# EAGLE design LoRa Mini v1.3 (EAGLE 7.5.0)
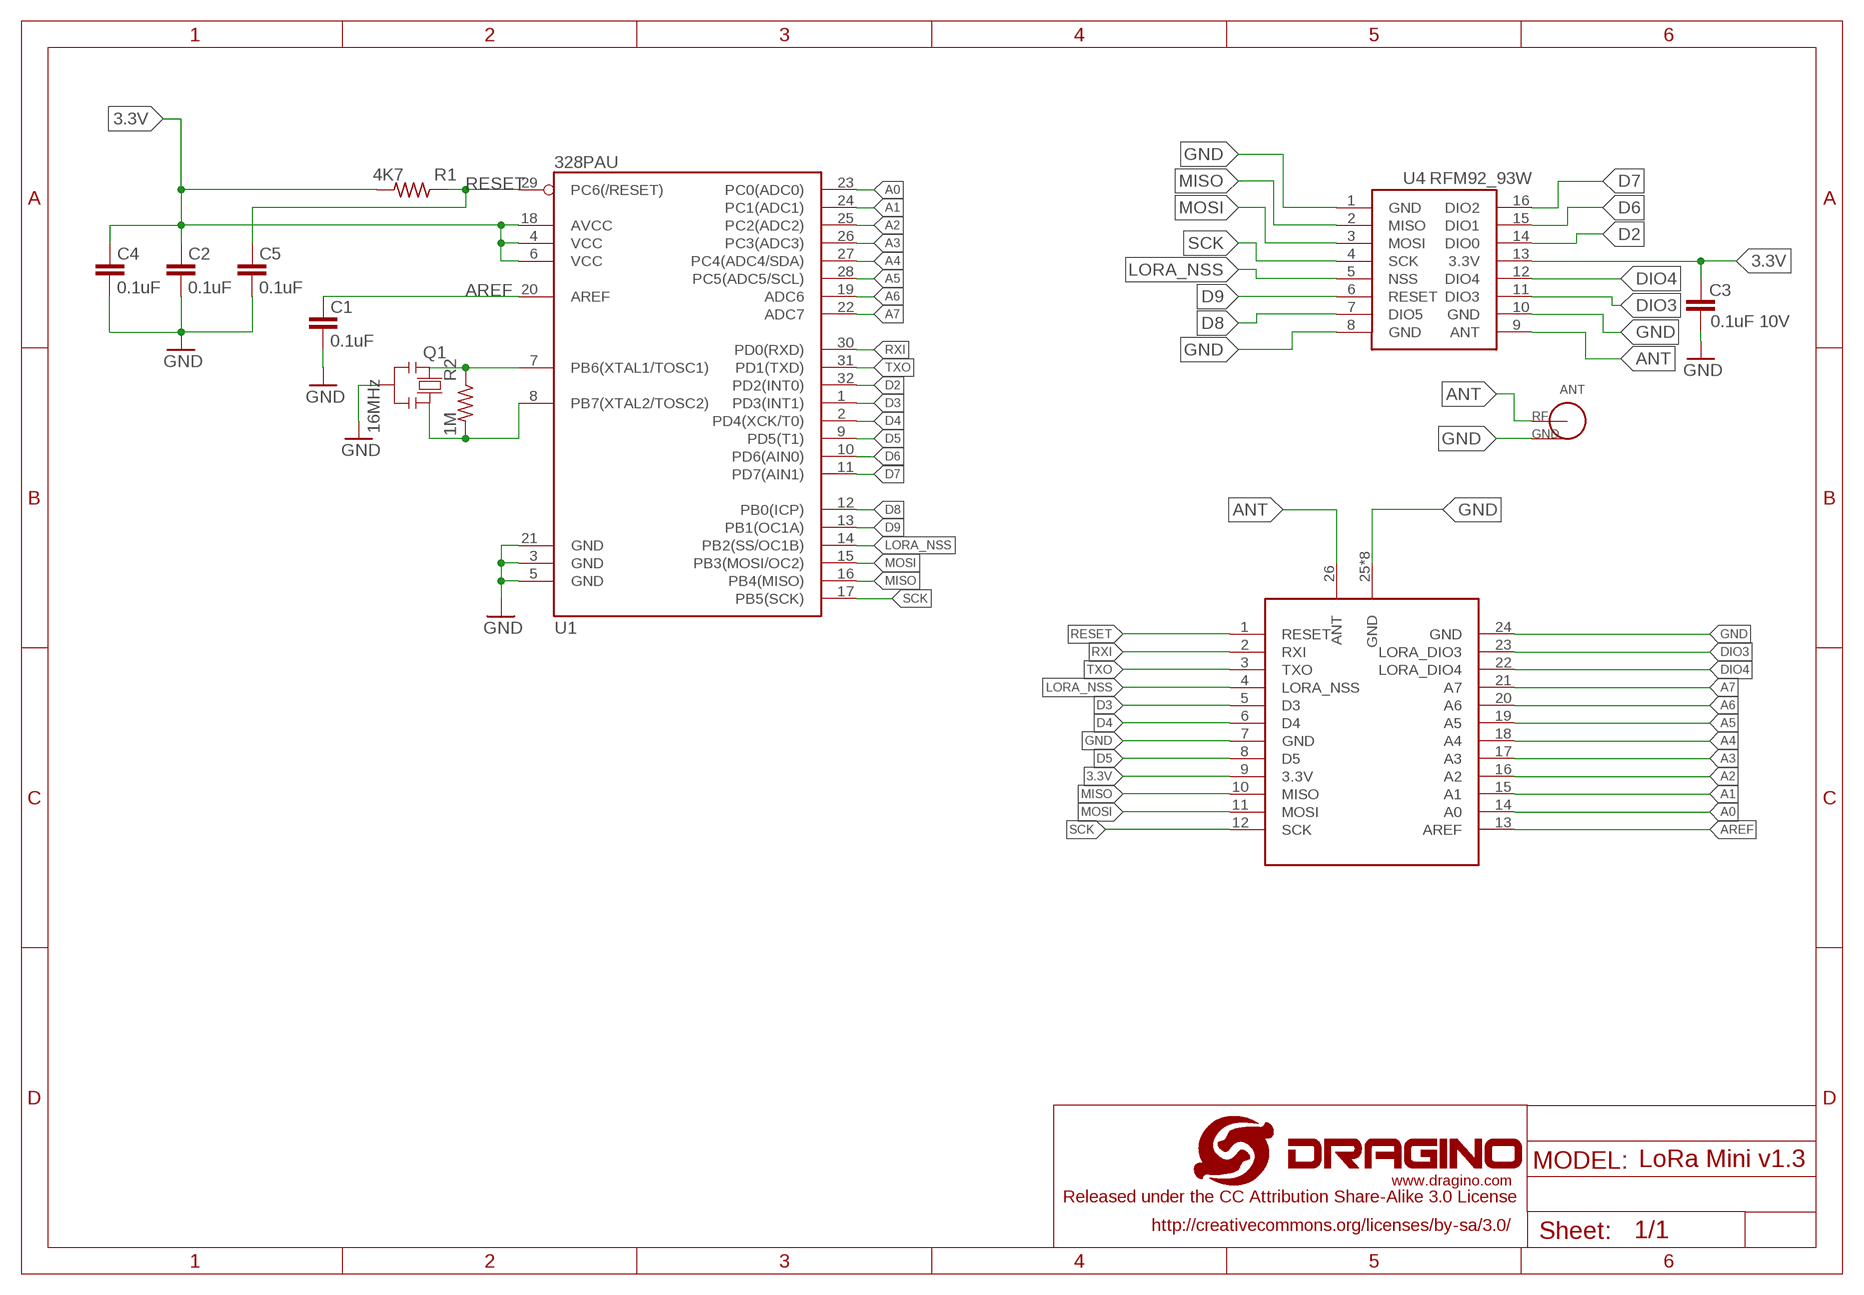
[diagram p0: schematic, sheet 1]

## Parts
ANT  I-PEX  [I-PEX]
C1  0.1uF  C-EUC0402  [C0402]
C2  0.1uF  C-EUC0402  [C0402]
C3  0.1uF 10V  C-EUC0402  [C0402]
C4  0.1uF  C-EUC0402  [C0402]
C5  0.1uF  C-EUC0402  [C0402]
Q1  16MHz  RESONATORMU  [RESONATOR]
R1  4K7  R-US_R0402  [R0402]
R2  1M  R-US_R0402  [R0402]
U1  328PAU  [328PAU]
U4  RFM92_93W  [RFM92_93W]
U$1  LORA328P_PCB  [LORA328P_PCB]

## Nets
3.3V: C2.2 C3.2 C4.2 R1.2 U1.4(VCC) U1.6(VCC) U1.18(AVCC) U4.13(3.3V) U$1.9(3.3V)
A0: U1.23(PC0(ADC0)) U$1.14(A0)
A1: U1.24(PC1(ADC1)) U$1.15(A1)
A2: U1.25(PC2(ADC2)) U$1.16(A2)
A3: U1.26(PC3(ADC3)) U$1.17(A3)
A4: U1.27(PC4(ADC4/SDA)) U$1.18(A4)
A5: U1.28(PC5(ADC5/SCL)) U$1.19(A5)
A6: U1.19(ADC6) U$1.20(A6)
A7: U1.22(ADC7) U$1.21(A7)
ANT [2layer-50ohm]: ANT.SIG U4.9(ANT) U$1.26(ANT)
AREF: C1.2 U1.20(AREF) U$1.13(AREF)
D2: U1.32(PD2(INT0)) U4.14(DIO0)
D3: U1.1(PD3(INT1)) U$1.5(D3)
D4: U1.2(PD4(XCK/T0)) U$1.6(D4)
D5: U1.9(PD5(T1)) U$1.8(D5)
D6: U1.10(PD6(AIN0)) U4.15(DIO1)
D7: U1.11(PD7(AIN1)) U4.16(DIO2)
D8: U1.12(PB0(ICP)) U4.7(DIO5)
D9: U1.13(PB1(OC1A)) U4.6(RESET)
DIO3: U4.11(DIO3) U$1.23(LORA_DIO3)
DIO4: U4.12(DIO4) U$1.22(LORA_DIO4)
GND [vcc]: ANT.GND ANT.GND1(GND) C1.1 C2.1 C3.1 C4.1 C5.1 Q1.2 U1.3(GND) U1.5(GND) U1.21(GND) U4.1(GND) U4.8(GND) U4.10(GND) U$1.7(GND) U$1.24(GND) U$1.25(GND) U$1.P$1(GND) U$1.P$2(GND) U$1.P$3(GND) U$1.P$4(GND) U$1.P$5(GND) U$1.P$6(GND) U$1.P$7(GND)
LORA_NSS: U1.14(PB2(SS/OC1B)) U4.5(NSS) U$1.4(LORA_NSS)
MISO: U1.16(PB4(MISO)) U4.2(MISO) U$1.10(MISO)
MOSI: U1.15(PB3(MOSI/OC2)) U4.3(MOSI) U$1.11(MOSI)
N$1: Q1.3 R2.2 U1.8(PB7(XTAL2/TOSC2))
N$2: Q1.1 R2.1 U1.7(PB6(XTAL1/TOSC1))
RESET: C5.2 R1.1 U1.29(PC6(/RESET)) U$1.1(RESET)
RXI: U1.30(PD0(RXD)) U$1.2(RXI)
SCK: U1.17(PB5(SCK)) U4.4(SCK) U$1.12(SCK)
TXO: U1.31(PD1(TXD)) U$1.3(TXO)

## Library data of the parts
ANT = dragino-passive:I-PEX: I-PEX, U.F.L connector
C1-C5 = dragino-passive:C-EU: CAPACITOR, European symbol
Q1 = SmartPrj:RESONATOR
R1 R2 = dragino:R-US_: RESISTOR, American symbol
U1 = 328PAU:328PAU
U4 = dragino:RFM92_93W
U$1 = lora328p:LORA328P_PCB

## Net classes
1 vcc: width 0.254 mm
2 2layer-50ohm: width 1 mm, clearance 0.2 mm

## Board
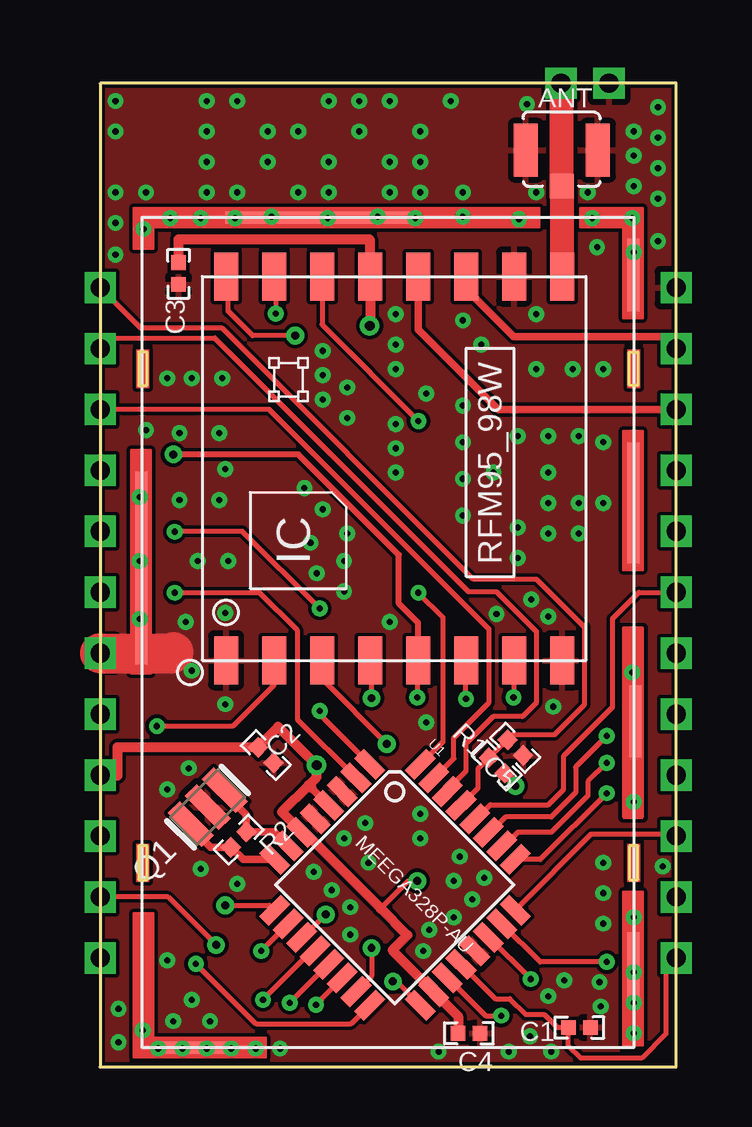
[diagram p1: board, top side]
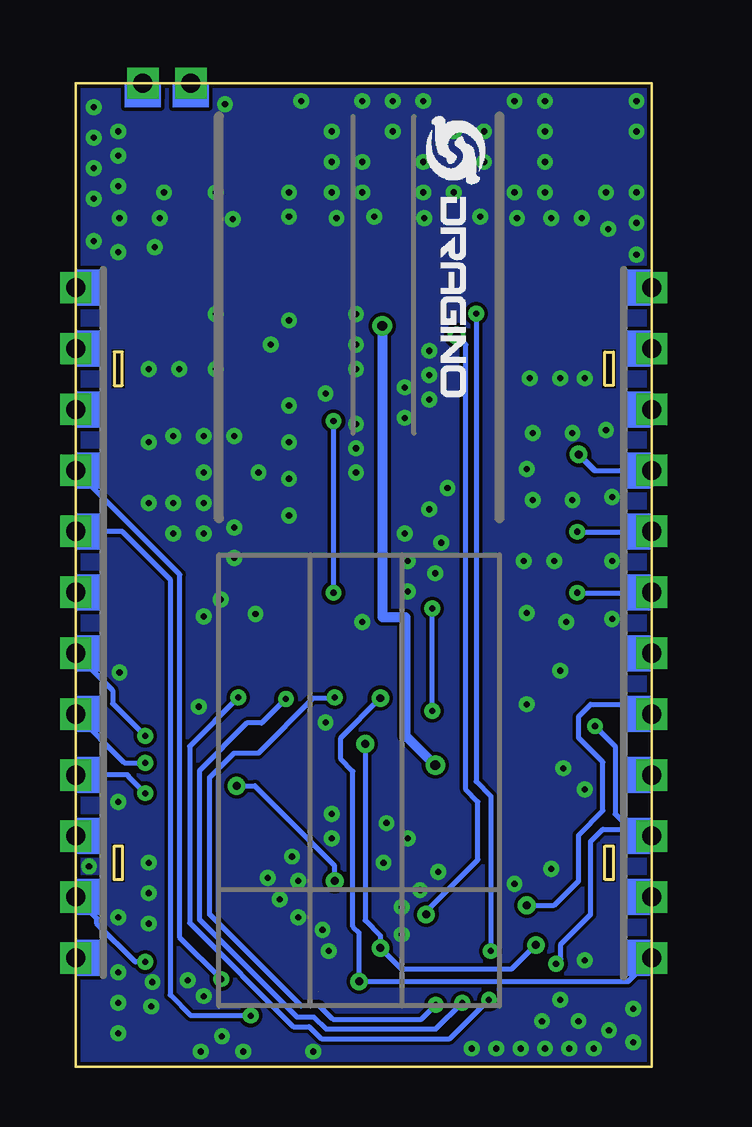
[diagram p2: board, bottom side, seen from below]

Size 24 x 41 mm. Coordinates in mm from the lower left corner, seen from the top.
Copper layers (1*16): Top 0.035mm / dielectric 1.5mm / Bottom 0.035mm
Design rules "default *": minimum track width 6mil, minimum drill 10mil, track to track 6mil, track to pad 6mil, pad to pad 6mil, via to via 6mil, smd to smd 6mil, copper to edge 6mil, drill to drill 8mil, minimum pad ring 10mil, minimum via ring 8mil, stop-mask expansion 4mil, vias tented up to drill 30mil, thermal gap 10mil

### Footprints (pad centres in the part's own frame; a part is rotated, then mirrored left to right if it is on the bottom)
I-PEX = smd 1 x 2.2: GND -1.65,-0.27; GND1 1.35,-0.27 | smd 1 x 1: SIG -0.15,-1.77
C0402 = smd 0.61 x 0.61: 1 -0.457,0; 2 0.457,0
RESONATOR = smd 0.7 x 2: 1 -1,0; 2 0,0; 3 1,0
R0402 = smd 0.61 x 0.61: 1 -0.457,0; 2 0.457,0
328PAU = smd 1.27 x 0.559: 1 -4.293,2.8; 2 -4.293,2; 3 -4.293,1.2; 4 -4.293,0.4; 5 -4.293,-0.4; 6 -4.293,-1.2; 7 -4.293,-2; 8 -4.293,-2.8; 17 4.293,-2.8; 18 4.293,-2; 19 4.293,-1.2; 20 4.293,-0.4; 21 4.293,0.4; 22 4.293,1.2; 23 4.293,2; 24 4.293,2.8 | smd 0.559 x 1.27: 9 -2.8,-4.293; 10 -2,-4.293; 11 -1.2,-4.293; 12 -0.4,-4.293; 13 0.4,-4.293; 14 1.2,-4.293; 15 2,-4.293; 16 2.8,-4.293; 25 2.8,4.293; 26 2,4.293; 27 1.2,4.293; 28 0.4,4.293; 29 -0.4,4.293; 30 -1.2,4.293; 31 -2,4.293; 32 -2.8,4.293
RFM92_93W = smd 2 x 1: 1 -8,7; 2 -8,5; 3 -8,3; 4 -8,1; 5 -8,-1; 6 -8,-3; 7 -8,-5; 8 -8,-7; 9 8,-7; 10 8,-5; 11 8,-3; 12 8,-1; 13 8,1; 14 8,3; 15 8,5; 16 8,7
LORA328P_PCB = drill 0.8 square: 1 0,32.48; 2 0,29.94; 3 0,27.4; 4 0,24.86; 5 0,22.32; 6 0,19.78; 7 0,17.24; 8 0,14.7; 9 0,12.16; 10 0,9.62; 11 0,7.08; 12 0,4.54; 13 24,4.54; 14 24,7.08; 15 24,9.62; 16 24,12.16; 17 24,14.7; 18 24,17.24; 19 24,19.78; 20 24,22.32; 21 24,24.86; 22 24,27.4; 23 24,29.94; 24 24,32.48; 25 21.2,41; 26 19.2,41 | smd 3 x 0.5: P$1 4,0.8 | smd 8 x 0.5: P$2 9.2,35.4 | smd 0.5 x 8: P$3 1.7,20.8 | smd 0.5 x 5: P$4 22.2,23.5 | smd 0.5 x 3: P$5 22.2,33; P$6 22.3,14.4; P$7 22.2,4.1

### Placement (x,y rotation side)
ANT  19.38,38.48 0 top
C1  19.97,1.64 180 top
C2  6.9,12.99 135 top
C3  3.26,33.07 90 top
C4  15.37,1.4 180 top
C5  17.29,13.3 135 top
Q1  4.47,10.82 225 top
R1  16.52,12.56 315 top
R2  5.77,9.47 225 top
U1  12.28,7.59 315 top
U4  12.24,24.94 90 top
U$1  0,0 0 top
U$3  [LOGO-SILK-NEW]  9.4,39.62 270 bottom

### Tracks (layer width: path | path; a pad name or v marks a point on that pad's centre or on a via)
3.3V  (via drill 0.33, 0.41)  (1 unrouted)
  Top 0.203: v13.21,7.75 12.83,7.75 11.68,6.6
  Top 0.305: U1.4 8.76,11.67 8.75,11.67
  Top 0.406: v11.23,30.89 11.24,30.89 U4.13 11.23,32.94 11.23,34.49 3.26,34.49 C3.2 | 8.8,11.63 8.79,11.63 8.75,11.67 8.69,11.73 | 8.69,11.73 7.57,10.62 8.39,9.79 U1.6 8.52,9.77 11.68,6.6 12.8,5.49 12.19,4.88 12.19,4.84 U1.18 | 8.69,11.73 9.02,12.07 v9.02,12.57 7.42,14.17 6.58,13.33 C2.2 0.71,13.32 0.71,12.14 0,12.14 U$1.9 | v17.3,11.71 17.3,11.79 R1.2 | 13.9,3.12 14.91,2.11 C4.2
  Bottom 0.203: v17.3,11.71 16.54,11.71 13.21,8.38 v13.21,7.75
  Bottom 0.406: v11.23,30.89 11.23,18.75 10.26,18.75 10.26,13.82 v9.02,12.57
A0  (via drill 0.25)
  Top 0.203: v21.11,4.37 18.32,4.37 U1.23
  Bottom 0.203: v21.11,4.37 21.51,4.37 23.11,5.97 23.11,6.19 U$1.14
A1
  Top 0.203: U1.24 20.47,9.7 23.88,9.7 23.92,9.7
  Top 0.406: U$1.15 23.88,9.62 23.88,9.7
A2  (via drill 0.25)
  Top 0.203: U1.25 18.34,8.64 v21.11,11.41
  Bottom 0.203: v21.11,11.41 21.81,12.11 21.81,12.16 U$1.16
A3  (via drill 0.25)
  Top 0.203: 16.78,9.21 U1.26 | 16.73,9.31 U1.26 | v21.11,12.68 20.32,11.89 20.32,11.3 18.8,9.78 17.4,9.78 16.83,9.21 U1.26
  Bottom 0.203: v21.11,12.68 21.97,12.68 U$1.17
A4  (via drill 0.25)
  Top 0.203: v21.11,13.79 19.81,12.5 19.81,11.43 18.8,10.41 16.89,10.41 16.25,9.77 U1.27
  Bottom 0.203: v21.11,13.79 22.46,15.14 22.46,15.7 U$1.18
A5
  Top 0.203: U1.28 15.67,10.34 16.26,10.92 18.67,10.92 19.3,11.56 19.3,12.95 21.34,14.99 21.34,18.67 22.45,19.78 U$1.19
A6  (via drill 0.25)
  Top 0.203: U1.19 14.48,3.7 16.05,2.13 v16.71,2.13
  Bottom 0.203: v16.71,2.13 19.2,2.13 20.07,3 20.07,20.32 22.07,22.32 U$1.20
A7  (via drill 0.25)
  Top 0.203: v17.93,3.66 16.19,5.4 U1.22
  Bottom 0.203: v17.93,3.66 19.66,5.39 19.66,20.52 U$1.21
ANT
  Top 0.406: U$1.26 19.23,41 19.23,40.64
  Top 1: U4.9 19.24,36.7 ANT.SIG 19.23,40.64 19.23,40.97
AREF
  Top 0.203: U1.20 16.45,2.85 17.07,2.85 17.73,2.18 18.49,2.18 19.04,1.64 C1.2 19.51,0.86 20.01,0.36 22.56,0.36 23.57,1.37 23.57,4.11 U$1.13
D2  (via drill 0.25)
  Top 0.203: U4.14 9.24,30.94 v13.26,26.92 | v13.26,19.76 14.28,18.75 14.28,13.54 U1.32
  Bottom 0.203: v13.26,26.92 v13.26,19.76
D3  (via drill 0.25)
  Top 0.203: U1.1 9.14,14.68 v9.14,14.83 | v9.14,19.1 5.93,22.32 3.12,22.32 v3.1,22.3
  Bottom 0.203: v9.14,14.83 v9.14,19.1 | v3.1,22.3 0.02,22.3
  Bottom 0.406: 0.02,22.3 0,22.3 U$1.5
D4  (via drill 0.25)
  Top 0.203: U1.2 8.23,14.46 8.23,18.19 6.64,19.78 6.62,19.76 v3.1,19.76
  Bottom 0.203: v3.1,19.76 0.02,19.76
  Bottom 0.406: 0.02,19.76 0,19.76 U$1.6
D5  (via drill 0.33)
  Top 0.203: v5.21,6.73 7.06,6.73 U1.9
  Bottom 0.203: v5.21,6.73 4.06,6.73 3.05,7.75 3.05,9.65 2.03,10.67 2.03,12.7 3.05,13.72 3.05,14.61 2.54,15.11 0.41,15.11 U$1.8
D6  (via drill 0.25)
  Top 0.203: U4.15 7.32,32.87 v7.32,31.39 | v6.71,4.83 v6.71,4.84 U1.10
  Bottom 0.203: v7.32,31.39 7.32,11.89 6.71,11.28 v6.71,4.83
D7  (via drill 0.33)
  Top 0.203: U1.11 8.45,5.4 v9.4,6.35 | v8.13,30.48 6.35,30.48 5.33,31.5 5.33,32.85 U4.16
  Bottom 0.203: v9.4,6.35 9.4,6.48 7.24,8.64 7.24,11.05 7.75,11.56 7.75,30.1 v8.13,30.48
D8  (via drill 0.25)
  Top 0.203: U4.7 17.22,16.92 v17.22,15.39 | U1.12 8.82,4.83 v6.78,2.79
  Bottom 0.203: v17.22,15.39 19.25,13.36 19.25,5.99 14.93,1.68 14.28,1.68 13.77,1.17 8.41,1.17 v6.78,2.79
D9  (via drill 0.25)
  Top 0.203: v15.24,15.34 U4.6 | U1.13 9.5,4.27 v7.9,2.67
  Bottom 0.203: v15.24,15.34 16.26,14.33 16.87,14.33 18.85,12.34 18.85,6.15 14.78,2.08 14.07,2.08 13.56,1.58 8.99,1.58 v7.9,2.67
DIO3
  Top 0.305: U4.11 15.24,32.41 17.22,30.43 23.51,30.43 U$1.23
DIO4
  Top 0.305: U4.12 13.26,32.93 13.26,30.73 16.59,27.4 U$1.22
GND  (via drill 0.25)
  Top 0.406: v22.17,16.43 22.3,16.43 U$1.P$6
  Top 1.676: U$1.7 3.02,17.24 3.05,17.27
  other vias: 0.64,40.26 4.45,40.26 5.71,40.26 9.52,40.26 10.79,40.26 12.07,40.26 14.61,40.26 0.64,38.99 0.64,36.45 4.45,38.99 6.98,38.99 10.79,38.99 13.33,38.99 12.07,37.72 13.33,37.72 13.33,36.45 12.07,36.45 9.52,36.45 9.52,37.72 4.45,37.72 6.98,37.72 1.91,36.45 4.45,36.45 5.71,36.45 8.25,36.45 8.25,38.99 22.22,38.99 23.24,40.01 23.24,38.74 23.24,37.47 23.24,36.2 22.22,36.7 22.22,37.97 15.11,36.45 23.24,34.42 20.7,34.16 18.16,31.37 12.32,31.37 15.11,31.12 20.96,29.08 19.68,29.08 18.16,29.08 15.88,30.1 12.32,30.1 12.32,29.08 9.27,29.84 9.27,28.83 9.27,27.81 10.29,28.32 10.29,27.05 12.32,26.8 12.32,25.78 12.32,24.77 15.11,27.56 15.11,26.04 15.11,24.51 15.11,22.99 13.59,28.07 17.4,26.29 17.4,22.48 17.4,21.21 16.38,24.77 18.67,26.29 19.94,26.29 18.67,24.77 18.67,23.5 19.94,23.5 19.94,22.23 18.67,22.23 20.96,23.5 20.96,26.04 22.22,11.05 20.96,8.51 20.96,7.24 20.96,5.97 22.22,6.22 22.22,3.94 22.22,2.67 22.22,1.4 20.8,3.53 20.85,2.51 6.48,0.76 5.46,0.76 4.45,0.76 3.43,0.76 2.41,0.76 1.78,1.52 0.76,2.41 0.76,1.02 3.05,1.91 4.57,1.91 2.79,4.45 5.71,7.62 3.56,18.54 1.65,18.67 1.65,21.08 1.65,23.75 4.06,21.08 5.33,21.08 4.95,23.62 3.3,23.62 1.91,26.54 3.3,26.42 4.95,26.42 8.51,24.13 9.27,23.24 10.29,22.23 10.16,21.08 10.16,19.81 9.02,20.57 8.76,21.84 12.07,18.54 5.21,15.11 3.81,16.51 2.79,11.56 3.68,12.45 4.19,8.26 8.89,8.13 9.65,7.37 11.05,10.16 10.16,9.52 11.18,8.51 16,7.87 15.49,6.98 14.73,7.75 13.72,5.71 14.73,6.22 10.41,6.65 18.8,0.64 17.02,0.64 14.1,0.64 2.79,28.7 5.08,28.7 3.81,28.7 7.49,0.76 19.33,3.61 13.46,4.83 18.67,2.95 23.44,8.36 16.51,18.87 0.64,35.18 0.64,33.86 1.8,34.93 2.92,35.38 4.19,35.38 5.61,35.38 7.14,35.43 9.47,35.38 11.56,35.43 13.13,35.38 15.11,35.43 17.45,35.33 20.5,35.38 22.17,35.38 22.22,33.96 5.21,24.92 5.21,18.92 18.87,15.01 18.67,18.77 17.96,19.48 17.78,40.13 18.16,36.45 20.32,36.45 13.33,10.54 13.33,9.52 13.59,14.35 14.99,8.76 3.81,2.79 17.91,1.27 10.41,5.51
  pour Top: -0.1,-0.2 24.23,-0.2 24.23,41.2 -0.2,41.2 -0.2,-0.2
  pour Bottom: -0.2,-0.2 24.23,-0.2 24.23,41.2 -0.2,41.2
LORA_NSS  (via drill 0.25, 0.33)
  Top 0.203: U4.5 13.21,16.91 v13.21,15.39 | U1.14 9.25,2.86 9.25,2.85 v8.99,2.59
  Top 0.254: U4.5 13.24,18.51 12.45,19.3 12.45,21.34 8.25,25.53 v3.05,25.53
  Bottom 0.203: v8.99,2.59 9.6,1.98 13.28,1.98 13.84,2.54 14.61,2.54 18.42,6.35 18.42,12.07 17.4,13.08 16.38,13.08 14.1,15.37 13.23,15.37 v13.21,15.39 | 2.38,24.86 U$1.4
  Bottom 0.254: v3.05,25.53 2.38,24.86
MISO  (via drill 0.25)
  Top 0.203: U4.2 7.24,15.93 5.51,14.2 v2.36,14.2 | U1.16 10.43,1.78 6.5,1.78 v3.99,4.29
  Bottom 0.203: v3.99,4.29 3.79,4.5 3.79,5.11 2.54,6.35 2.54,9.4 2.03,9.91 0.46,9.91 | v2.36,14.2 1.52,13.36 1.52,10.54 0.84,9.86 0.51,9.86 | 0.51,9.86 0.23,9.86 | U$1.10 0.29,9.91 0.46,9.91 | 0.46,9.91 0.51,9.86
MOSI  (via drill 0.33)
  Top 0.203: U4.3 9.24,16.16 v11.94,13.46 | v11.3,4.95 11.3,3.78 U1.15 | v4.83,5.08 2.83,7.08 U$1.11
  Bottom 0.203: v11.94,13.46 11.94,6.1 11.3,5.46 v11.3,4.95 10.41,4.06 5.84,4.06 v4.83,5.08
N$1
  Top 0.305: U1.8 5.95,8.64 R2.2 4.61,9.15 3.77,9.99 Q1.3
N$2
  Top 0.305: U1.7 7.24,9.8 R2.1 6.09,10.49 5.18,11.4 Q1.1
RESET
  Top 0.203: U1.29 15.75,11.62 15.75,12.44 R1.1 | 16.19,12.88 R1.1 | R1.1 16.94,13.63 C5.2 17.19,13.84 18.92,13.84 20.17,15.09 20.17,18.34 18.19,20.32 15.54,20.32 5.08,30.79 1.7,30.79 U$1.1
RXI
  Top 0.203: 14.47,11.52 U1.30 14.47,11.55 15.24,12.32 15.24,13.46 16.38,14.61 17.6,14.61 18.19,15.19 18.19,18.14 16.51,19.81 15.34,19.81 4.77,30.38 0.44,30.38 U$1.2
SCK  (via drill 0.33)
  Top 0.203: U1.17 12.35,3.56 v12.19,3.56 | v11.3,15.37 11.3,16.88 U4.4
  Bottom 0.203: v11.3,15.37 12.95,13.72 12.95,12.83 12.45,12.32 12.45,5.84 12.19,5.59 v12.19,3.56 0.98,3.56 U$1.12
TXO
  Top 0.203: U1.31 13.92,12.04 14.73,12.85 14.73,13.72 16.21,15.19 16.21,18.24 7.04,27.4 U$1.3

### Text on the board
bDocu: LoRa Mini v 1.3 | OPEN-SOURCE | WWW.DRAGINO.COM | ANT | GND | RST | GND | LoRa MODEL. | RXI | DIO3 | TXO | DIO4 | NSS | A7 | D3 | A6 | 433 MHZ | 868 MHZ | 915/920 MHZ | D4 | A5 | GND | A4 | D5 | A3 | 3.3V | A2 | A1 | MISO | MOSI | A0 | SCK | AREF